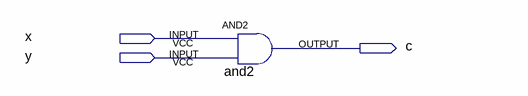
[diagram p0: schematic sheet]
// Quartus schematic test2.bdf as structural Verilog: 1 symbols, 3 pins
module test2 (
  input  x,
  input  y,
  output c
);

  and and2 (c, x, y);
endmodule
